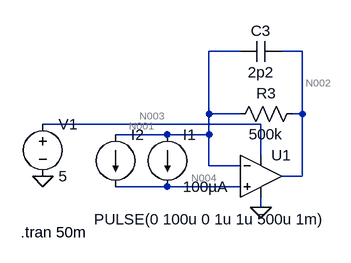
[diagram p0: schematic TIA.asc]
TIA.asc, the LTspice schematic file:
Version 4
SHEET 1 880 680
WIRE 128 -16 80 -16
WIRE 224 -16 192 -16
WIRE 80 80 80 -16
WIRE 128 80 80 80
WIRE 224 80 224 -16
WIRE 224 80 208 80
WIRE 160 96 -176 96
WIRE 16 112 -64 112
WIRE 80 112 80 80
WIRE 80 112 16 112
WIRE 160 144 160 96
WIRE 80 160 80 112
WIRE 128 160 80 160
WIRE 224 176 224 80
WIRE 224 176 192 176
WIRE 16 192 -64 192
WIRE 128 192 16 192
WIRE 160 224 160 208
FLAG 160 224 0
FLAG -176 176 0
SYMBOL cap 128 0 R270
WINDOW 0 32 32 VTop 2
WINDOW 3 0 32 VBottom 2
SYMATTR InstName C3
SYMATTR Value 2p2
SYMBOL res 112 96 R270
WINDOW 0 32 56 VTop 2
WINDOW 3 0 56 VBottom 2
SYMATTR InstName R3
SYMATTR Value 500k
SYMBOL voltage -176 80 R0
WINDOW 123 0 0 Left 2
WINDOW 39 0 0 Left 2
SYMATTR InstName V1
SYMATTR Value 5
SYMBOL current 16 112 R0
WINDOW 123 0 0 Left 2
WINDOW 39 0 0 Left 2
SYMATTR InstName I1
SYMATTR Value 100µA
SYMBOL current -64 112 R0
WINDOW 3 -33 130 Left 2
WINDOW 123 0 0 Left 2
WINDOW 39 0 0 Left 2
SYMATTR Value PULSE(0 100u 0 1u 1u 500u 1m)
SYMATTR InstName I2
SYMBOL Opamps\\UniversalOpamp2 160 176 R0
SYMATTR InstName U1
TEXT -210 262 Left 2 !.tran 50m

The netlist it stands for:
* TIA.asc
C3 N001 N002 2p2
R3 N001 N002 500k
V1 N003 0 5
I1 N001 N004 100µA
I2 N001 N004 PULSE(0 100u 0 1u 1u 500u 1m)
XU1 N004 N001 N003 0 N002 level.2 Avol=1Meg GBW=10Meg Slew=10Meg ilimit=25m rail=0 Vos=0 phimargin=45 en=0 enk=0 in=0 ink=0 Rin=500Meg  ; pins IN+ IN- V+ V- OUT
.tran 50m
.lib UniversalOpamps2.sub
.backanno
.end

* Results of the author's LTspice run, read from the files saved beside the schematic
* Operating Point, zero values left out:
*   V(n001) = -44.95 V
*   V(n002) = 4.999 V
*   V(n003) = 5 V
*   V(n004) = 50 kV
*   I(I1) = 100 µA
*   I(R3) = -99.91 µA
*   I(V1) = -50.48 µA
*   Ix(u1:1) = 100 µA
*   Ix(u1:2) = -94.91 nA
*   Ix(u1:3) = 50.48 µA
*   Ix(u1:4) = -50.55 µA
*   Ix(u1:5) = -99.91 µA
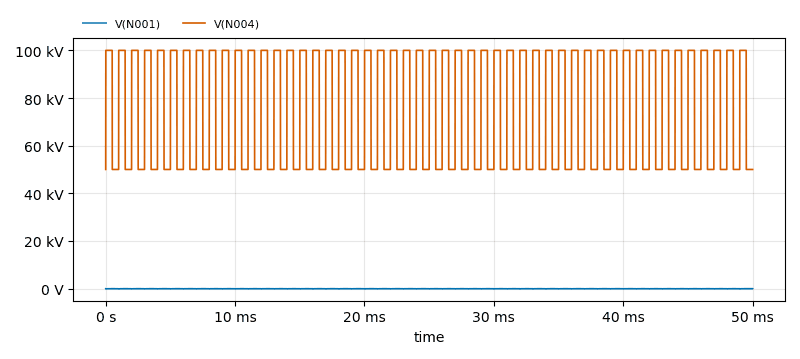
[diagram p1: Transient Analysis of TIA.asc, plotted from the saved traces]
* Transient Analysis, 1 run:
*   V(N001): min -94.91 V, max -44.95 V, average -69.98 V, rms 74.28 V, last -44.95 V
*   V(N004): min 50 kV, max 100 kV, average 75.05 kV, rms 79.1 kV, last 50 kV